# EAGLE schematic Cellphone-Detector-LM358-Flip-Flop-2X (EAGLE 7.2.0)
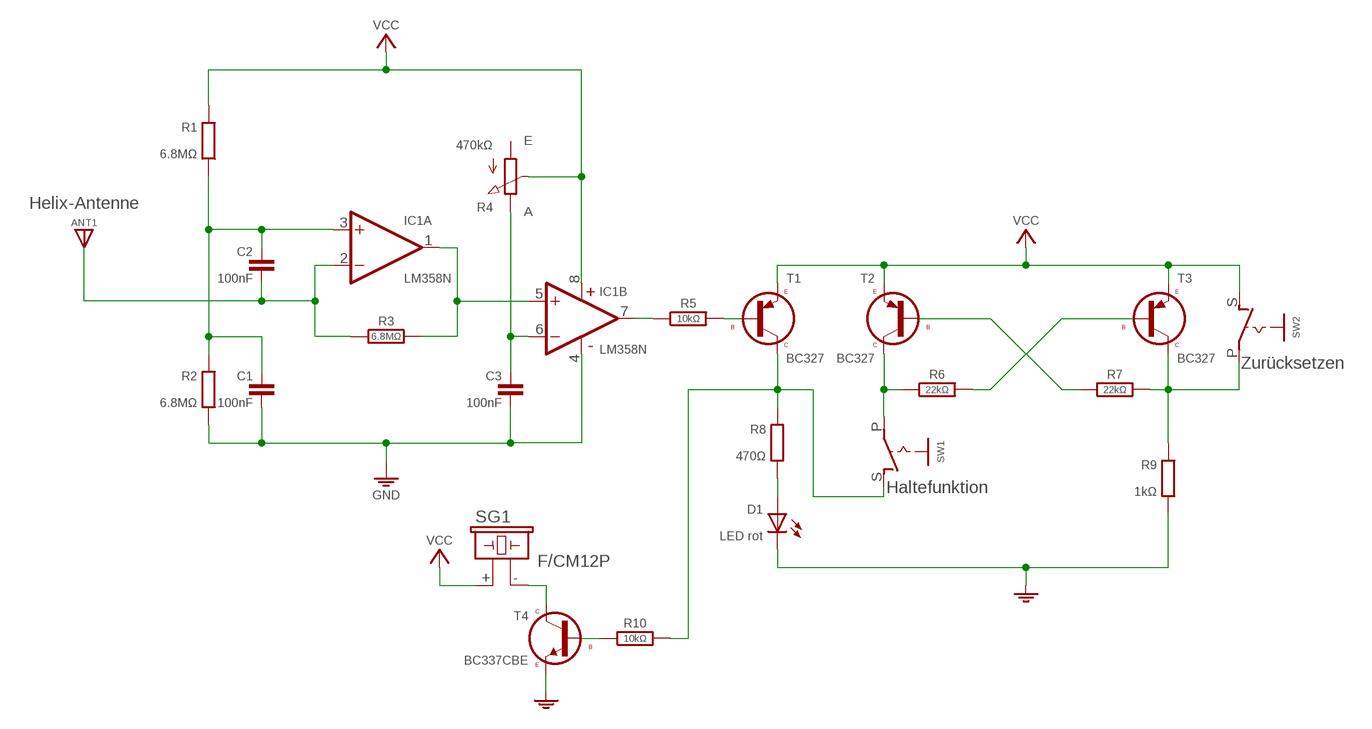
[diagram p0: schematic, sheet 1]

## Parts
ANT1  ANT  [SPAD]
C1  100nF  C025-025X060  [C050-025X060]
C2  100nF  C025-024X044  [C025-024X044]
C3  100nF  C025-024X044  [C025-024X044]
D1  LED rot  LED-3MM/V  [LED_3MM/V]
IC1  LM358N  [DIL08]
R1  6.8MΩ  R0204/2  [0204/2]
R2  6.8MΩ  R0204/2V  [0204/2V]
R3  6.8MΩ  R-H0202/2V  [0202/2V]
R4  470kΩ  POT-3P  [CONN-3P]
R5  10kΩ  R-H0204/10  [0204/10]
R6  22kΩ  R-H0204/10  [0204/10]
R7  22kΩ  R-H0204/10  [0204/10]
R8  470Ω  R0204/10-V  [0204/10-V]
R9  1kΩ  R0204/10  [0204/10]
R10  10kΩ  R-H0204/10  [0204/10]
S1  VCC_GNDR  [SPAD+-]
SG1  F/CM12P  [F/CM12P]
SW1  SW1  SL-SW-1P-1T  [SLSW-1P1T]
SW2  PB-1P-1T-2P  [SLSW-1P1T]
T1  BC327  [TO92]
T2  BC327  [TO92]
T3  BC327  [TO92]
T4  BC337CBE  [TO92-CBE]

## Nets
ANT: ANT1.1 C2.2 IC1.2(A:-IN) R3.1
GND: C1.2 C3.2 D1.K(C) IC1.4(P:V-) R2.2 R9.2 S1.1 T4.3(E)
N$1: C3.1 IC1.6(B:-IN) R4.3(E)
N$2: SG1.- T4.1(C)
N$3: IC1.7(B:OUT) R5.1
N$4: C1.1 C2.1 IC1.3(A:+IN) R1.2 R2.1
N$5: R7.2 R9.1 SW2.P T3.1(C)
N$6: R6.1 SW1.P T2.1(C)
N$7: R6.2 T3.2(B)
N$8: R10.1 T4.2(B)
N$9: R7.1 T2.2(B)
N$12: D1.A R8.2
N$13: R8.1 R10.2 SW1.S T1.1(C)
N$14: R5.2 T1.2(B)
SIG: IC1.1(A:OUT) IC1.5(B:+IN) R3.2
VCC: IC1.8(P:V+) R1.1 R4.2(S) S1.2 SG1.+ SW2.S T1.3(E) T2.3(E) T3.3(E)
Unconnected: R4.1(A)

## Notes on the sheet
- Helix-Antenne
- Zurücksetzen
- Haltefunktion

## Library data of the parts
ANT1 = pad:ANT
C1-C3 = c:C: CAPACITOR, European symbol
D1 = d:LED
IC1 = ic:LM358: OP AMP also LM158; LM258; LM2904 Source: http://cache.national.com/ds/LM/LM158.pdf
R1 R2 R8 R9 = r:R: RESISTOR, European symbol
R3 R5-R7 R10 = r:R-H
R4 = r:POT
S1 = pad:VCC_GND
SG1 = buzzer:F/CM12P: BUZZER Source: Buerklin; OC_FARNELL: unknown; OC_NEWARK: unknown
SW1 = sw:SL-SW-1P-1T
SW2 = sw:PB-1P-1T
T1-T3 = t:BC327
T4 = t:BC337

## Net classes
0 default: clearance 0.406 mm